# EAGLE schematic PhotonOnAStick (EAGLE 7.3.0)
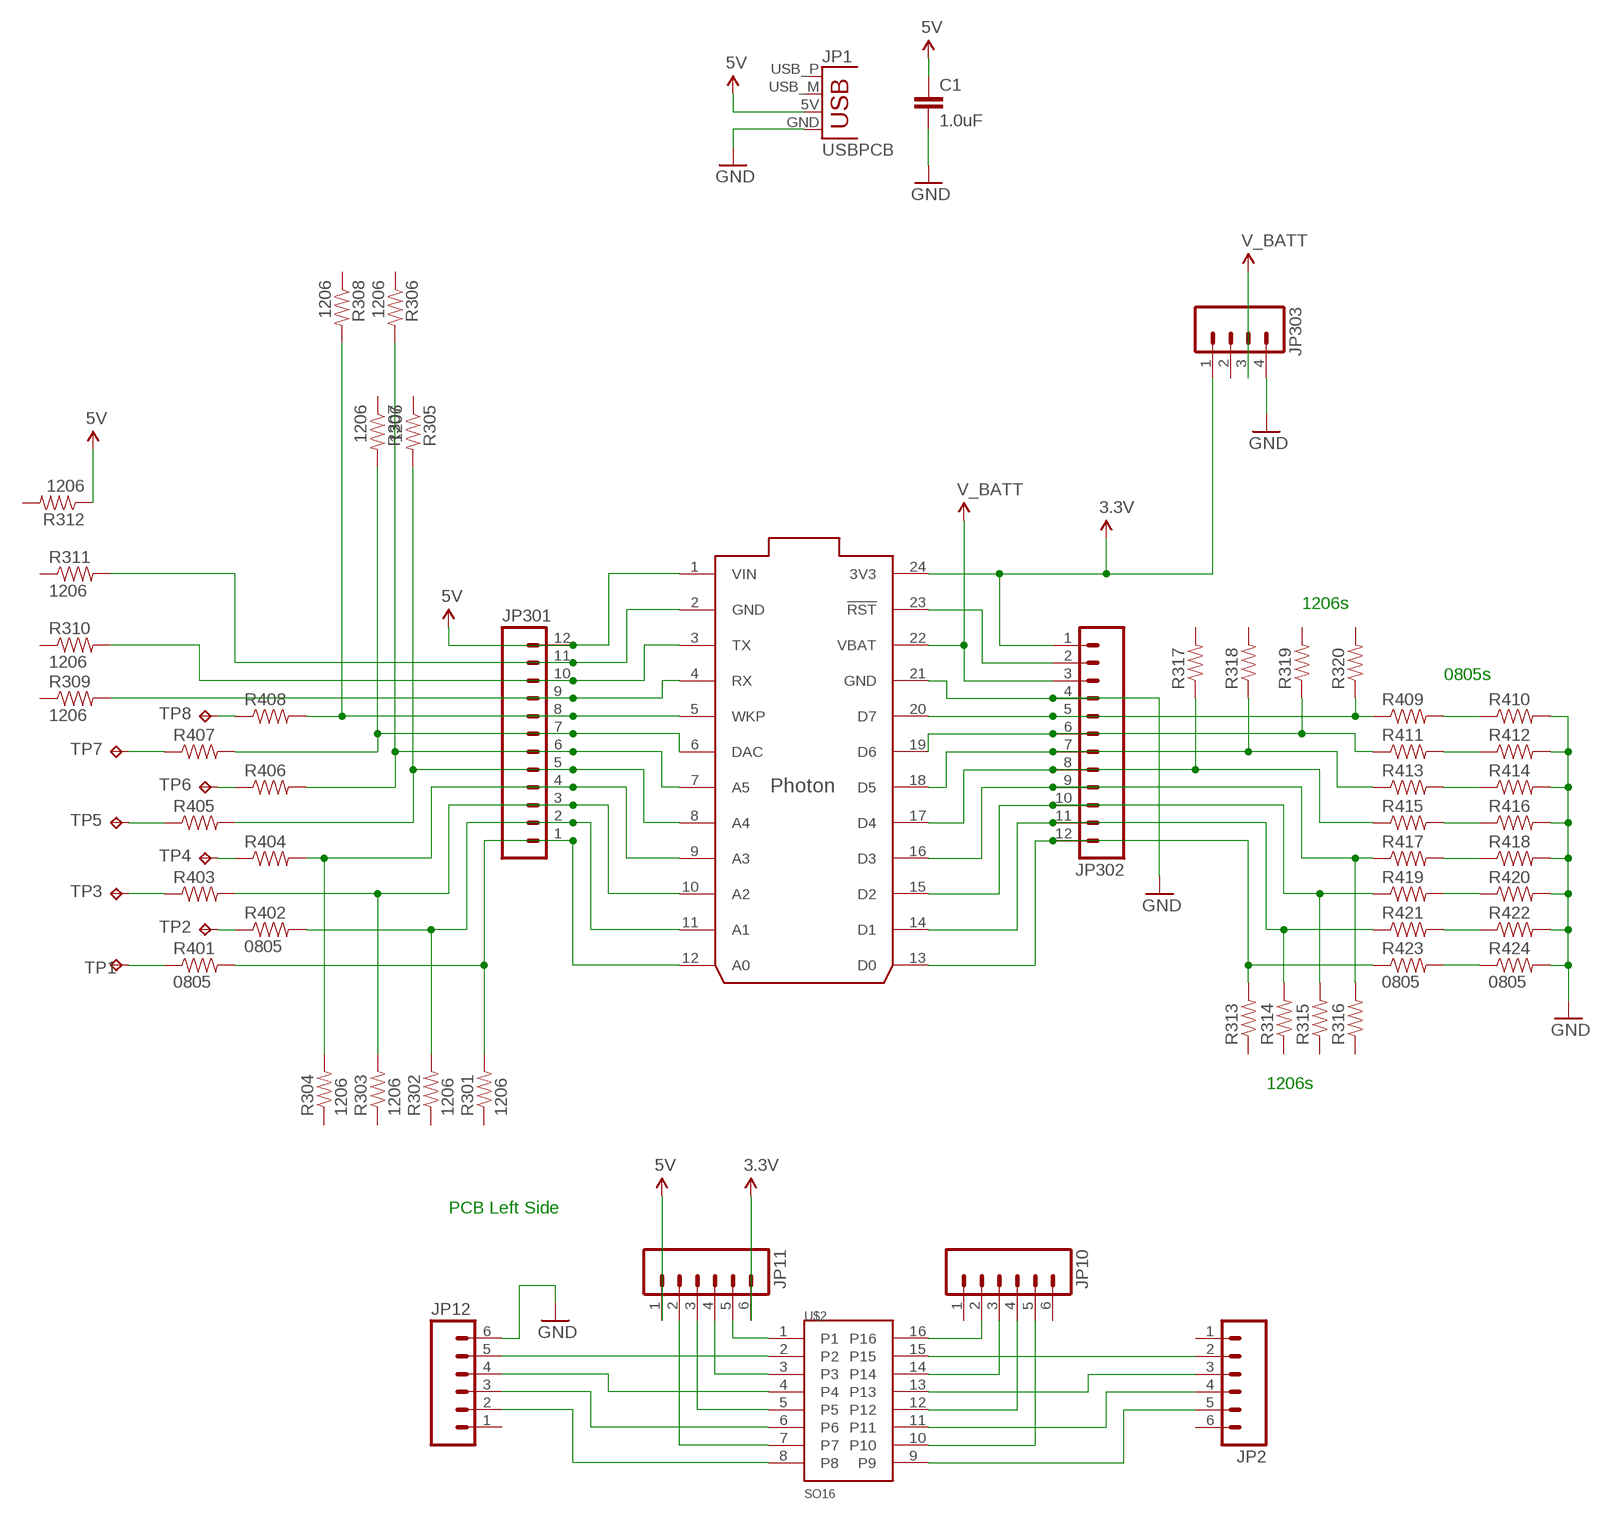
[diagram p0: schematic, sheet 1, part 1 of 2]
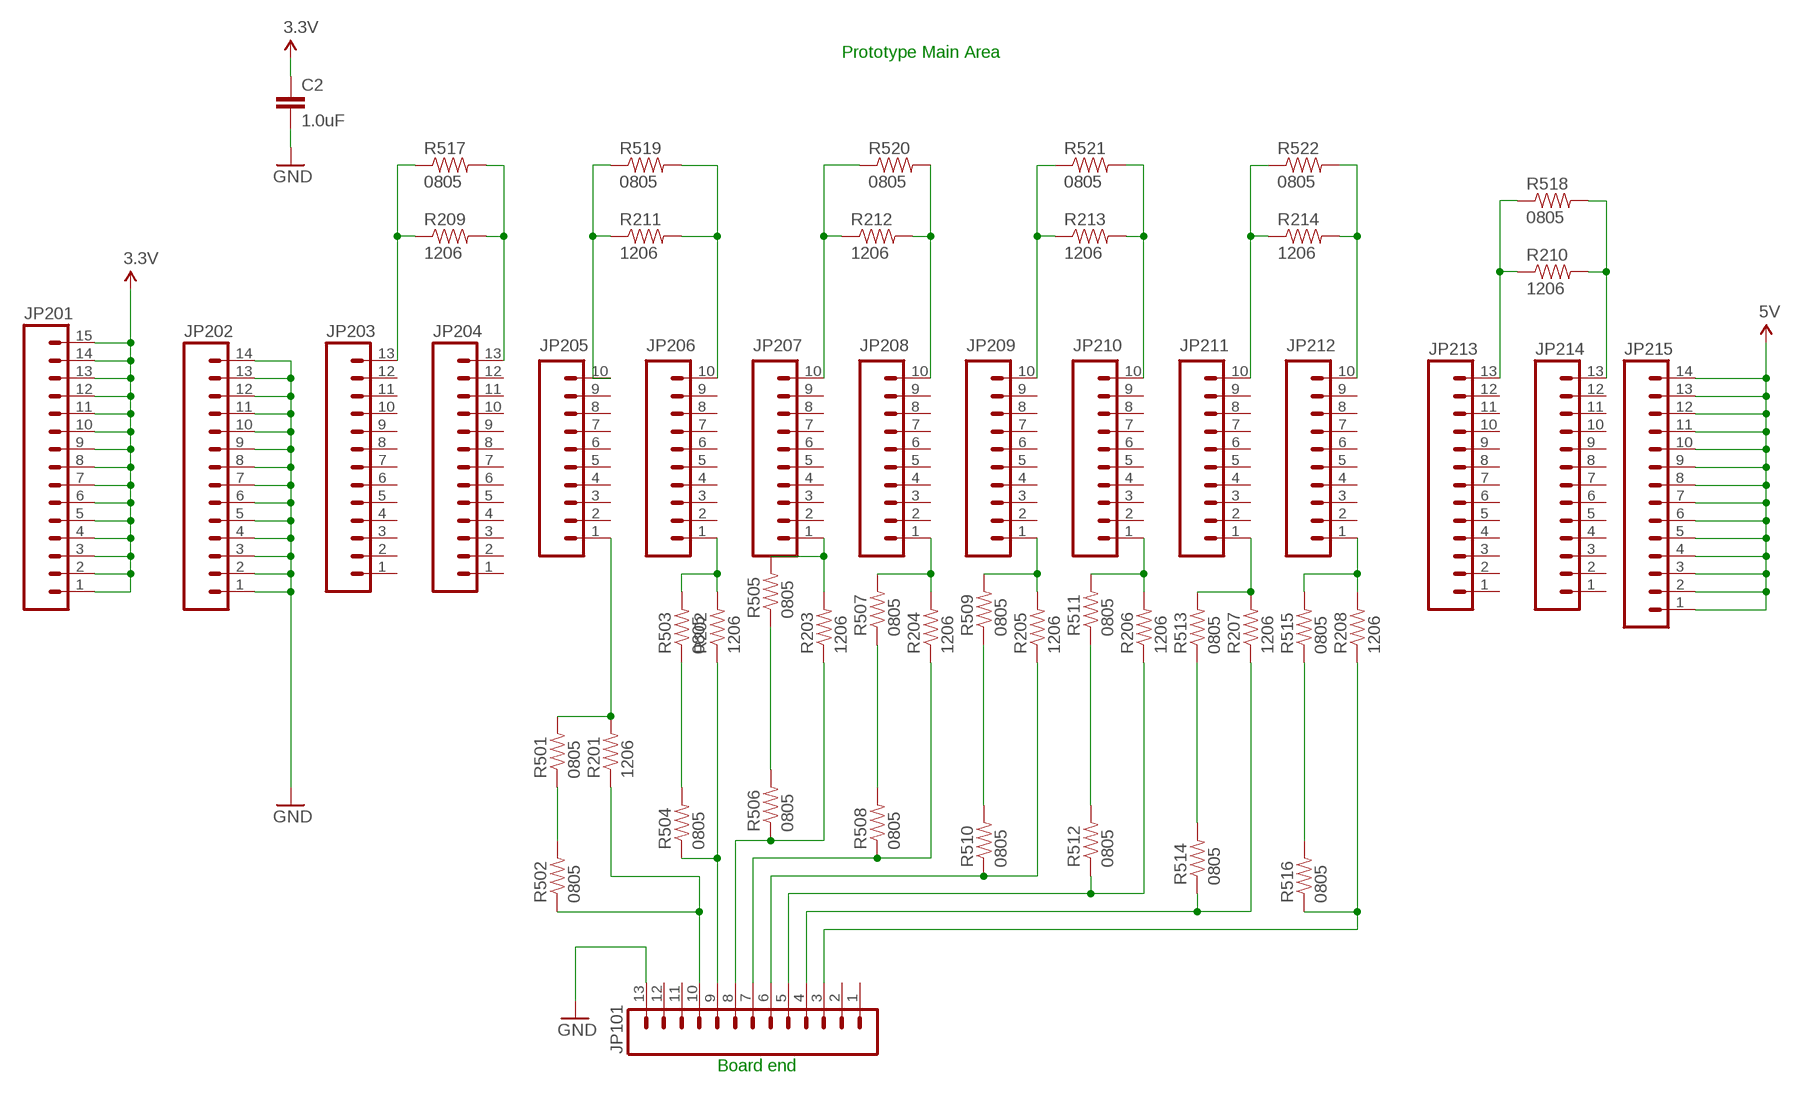
[diagram p1: schematic, sheet 1, part 2 of 2]

## Parts
C1  1.0uF  1.0UF-25V-+80/-20(0805)"  [0805-CAP]
C2  1.0uF  1.0UF-25V-+80/-20(0805)"  [0805-CAP]
JP1  USBPCB  [USB-A-PCB]
JP2  M06SILK_FEMALE_PTH  [1X06]
JP10  M06SILK_FEMALE_PTH  [1X06]
JP11  M06SILK_FEMALE_PTH  [1X06]
JP12  M06SILK_FEMALE_PTH  [1X06]
JP101  M13  [1X13]
JP201  M15  [1X15]
JP202  M14  [1X14]
JP203  M13  [1X13]
JP204  M13  [1X13]
JP205  M10SILK_FEMALE_PTH  [1X10]
JP206  M10SILK_FEMALE_PTH  [1X10]
JP207  M10SILK_FEMALE_PTH  [1X10]
JP208  M10SILK_FEMALE_PTH  [1X10]
JP209  M10SILK_FEMALE_PTH  [1X10]
JP210  M10SILK_FEMALE_PTH  [1X10]
JP211  M10SILK_FEMALE_PTH  [1X10]
JP212  M10SILK_FEMALE_PTH  [1X10]
JP213  M13  [1X13]
JP214  M13  [1X13]
JP215  M14  [1X14]
JP301  M12PTH  [1X12]
JP302  M12PTH  [1X12]
JP303  M04PTH  [1X04]
R201  1206  RESISTOR1206  [1206]
R202  1206  RESISTOR1206  [1206]
R203  1206  RESISTOR1206  [1206]
R204  1206  RESISTOR1206  [1206]
R205  1206  RESISTOR1206  [1206]
R206  1206  RESISTOR1206  [1206]
R207  1206  RESISTOR1206  [1206]
R208  1206  RESISTOR1206  [1206]
R209  1206  RESISTOR1206  [1206]
R210  1206  RESISTOR1206  [1206]
R211  1206  RESISTOR1206  [1206]
R212  1206  RESISTOR1206  [1206]
R213  1206  RESISTOR1206  [1206]
R214  1206  RESISTOR1206  [1206]
R301  1206  RESISTOR1206  [1206]
R302  1206  RESISTOR1206  [1206]
R303  1206  RESISTOR1206  [1206]
R304  1206  RESISTOR1206  [1206]
R305  1206  RESISTOR1206  [1206]
R306  1206  RESISTOR1206  [1206]
R307  1206  RESISTOR1206  [1206]
R308  1206  RESISTOR1206  [1206]
R309  1206  RESISTOR1206  [1206]
R310  1206  RESISTOR1206  [1206]
R311  1206  RESISTOR1206  [1206]
R312  1206  RESISTOR1206  [1206]
R313  1206  RESISTOR1206  [1206]
R314  1206  RESISTOR1206  [1206]
R315  1206  RESISTOR1206  [1206]
R316  1206  RESISTOR1206  [1206]
R317  1206  RESISTOR1206  [1206]
R318  1206  RESISTOR1206  [1206]
R319  1206  RESISTOR1206  [1206]
R320  1206  RESISTOR1206  [1206]
R401  0805  RESISTOR0805-RES  [0805]
R402  0805  RESISTOR0805-RES  [0805]
R403  0805  RESISTOR0805-RES  [0805]
R404  0805  RESISTOR0805-RES  [0805]
R405  0805  RESISTOR0805-RES  [0805]
R406  0805  RESISTOR0805-RES  [0805]
R407  0805  RESISTOR0805-RES  [0805]
R408  0805  RESISTOR0805-RES  [0805]
R409  0805  RESISTOR0805-RES  [0805]
R410  0805  RESISTOR0805-RES  [0805]
R411  0805  RESISTOR0805-RES  [0805]
R412  0805  RESISTOR0805-RES  [0805]
R413  0805  RESISTOR0805-RES  [0805]
R414  0805  RESISTOR0805-RES  [0805]
R415  0805  RESISTOR0805-RES  [0805]
R416  0805  RESISTOR0805-RES  [0805]
R417  0805  RESISTOR0805-RES  [0805]
R418  0805  RESISTOR0805-RES  [0805]
R419  0805  RESISTOR0805-RES  [0805]
R420  0805  RESISTOR0805-RES  [0805]
R421  0805  RESISTOR0805-RES  [0805]
R422  0805  RESISTOR0805-RES  [0805]
R423  0805  RESISTOR0805-RES  [0805]
R424  0805  RESISTOR0805-RES  [0805]
R501  0805  RESISTOR0805-RES  [0805]
R502  0805  RESISTOR0805-RES  [0805]
R503  0805  RESISTOR0805-RES  [0805]
R504  0805  RESISTOR0805-RES  [0805]
R505  0805  RESISTOR0805-RES  [0805]
R506  0805  RESISTOR0805-RES  [0805]
R507  0805  RESISTOR0805-RES  [0805]
R508  0805  RESISTOR0805-RES  [0805]
R509  0805  RESISTOR0805-RES  [0805]
R510  0805  RESISTOR0805-RES  [0805]
R511  0805  RESISTOR0805-RES  [0805]
R512  0805  RESISTOR0805-RES  [0805]
R513  0805  RESISTOR0805-RES  [0805]
R514  0805  RESISTOR0805-RES  [0805]
R515  0805  RESISTOR0805-RES  [0805]
R516  0805  RESISTOR0805-RES  [0805]
R517  0805  RESISTOR0805-RES  [0805]
R518  0805  RESISTOR0805-RES  [0805]
R519  0805  RESISTOR0805-RES  [0805]
R520  0805  RESISTOR0805-RES  [0805]
R521  0805  RESISTOR0805-RES  [0805]
R522  0805  RESISTOR0805-RES  [0805]
TP1  TPB1,27  [B1,27]
TP2  TPB1,27  [B1,27]
TP3  TPB1,27  [B1,27]
TP4  TPB1,27  [B1,27]
TP5  TPB1,27  [B1,27]
TP6  TPB1,27  [B1,27]
TP7  TPB1,27  [B1,27]
TP8  TPB1,27  [B1,27]
U$1  PHOTON_WITH_HEADERS  [PHOTON]
U$2  SO16  [SO16]

## Nets
3.3V: C2.1 JP11.6 JP201.1 JP201.2 JP201.3 JP201.4 JP201.5 JP201.6 JP201.7 JP201.8 JP201.9 JP201.10 JP201.11 JP201.12 JP201.13 JP201.14 JP201.15 JP302.1 JP303.1 U$1.24(3V3)
5V: C1.1 JP1.5V(VBUS) JP11.1 JP215.1 JP215.2 JP215.3 JP215.4 JP215.5 JP215.6 JP215.7 JP215.8 JP215.9 JP215.10 JP215.11 JP215.12 JP215.13 JP215.14 JP301.12 R312.1 U$1.1(VIN)
GND: C1.2 C2.2 JP1.GND JP12.6 JP101.13 JP202.1 JP202.2 JP202.3 JP202.4 JP202.5 JP202.6 JP202.7 JP202.8 JP202.9 JP202.10 JP202.11 JP202.12 JP202.13 JP202.14 JP302.4 JP303.4 R410.2 R412.2 R414.2 R416.2 R418.2 R420.2 R422.2 R424.2 U$1.21(GND)
N$1: JP214.13 R210.2 R518.2
N$2: JP206.1 R202.2 R503.2
N$3: JP301.11 R311.2 U$1.2(GND)
N$4: JP301.10 R310.2 U$1.3(TX)
N$5: JP301.9 R309.2 U$1.4(RX)
N$6: JP301.8 R308.2 R408.2 U$1.5(WKP)
N$7: JP301.7 R307.2 R407.2 U$1.6(DAC)
N$8: JP301.6 R306.2 R406.2 U$1.7(A5)
N$9: JP301.5 R305.2 R405.2 U$1.8(A4)
N$10: JP301.4 R304.2 R404.2 U$1.9(A3)
N$11: JP301.3 R303.2 R403.2 U$1.10(A2)
N$12: JP301.2 R302.2 R402.2 U$1.11(A1)
N$13: JP301.1 R301.2 R401.2 U$1.12(A0)
N$14: JP204.13 R209.2 R517.2
N$15: JP213.13 R210.1 R518.1
N$16: JP302.7 R318.1 R413.1 U$1.18(D5)
N$17: JP302.8 R317.1 R415.1 U$1.17(D4)
N$18: JP302.9 R316.2 R417.1 U$1.16(D3)
N$19: JP302.10 R315.2 R419.1 U$1.15(D2)
N$20: JP302.11 R314.2 R421.1 U$1.14(D1)
N$21: JP302.12 R313.2 R423.1 U$1.13(D0)
N$22: JP209.1 R205.2 R509.2
N$23: R513.1 R514.2
N$24: JP302.2 U$1.23(!RST)
N$25: R409.2 R410.1
N$26: JP207.1 R203.2 R505.2
N$27: JP208.1 R204.2 R507.2
N$28: JP101.9 R202.1 R504.1
N$29: JP101.8 R203.1 R506.1
N$30: JP101.7 R204.1 R508.1
N$31: JP101.6 R205.1 R510.1
N$32: JP205.1 R201.2 R501.2
N$33: JP101.10 R201.1 R502.1
N$34: JP210.1 R206.2 R511.2
N$35: JP211.1 R207.2 R513.2
N$36: JP101.5 R206.1 R512.1
N$37: JP101.4 R207.1 R514.1
N$38: JP302.5 R320.1 R409.1 U$1.20(D7)
N$39: JP302.6 R319.1 R411.1 U$1.19(D6)
N$40: R515.1 R516.2
N$43: R511.1 R512.2
N$44: R423.2 R424.1
N$45: R421.2 R422.1
N$46: R419.2 R420.1
N$47: R417.2 R418.1
N$48: R415.2 R416.1
N$49: R413.2 R414.1
N$50: R411.2 R412.1
N$51: R509.1 R510.2
N$52: R503.1 R504.2
N$53: R501.1 R502.2
N$54: R505.1 R506.2
N$55: JP203.13 R209.1 R517.1
N$56: JP212.1 R208.2 R515.2
N$57: JP101.3 R208.1 R516.1
N$58: R408.1 TP8.TP
N$59: R407.1 TP7.TP
N$60: R405.1 TP5.TP
N$61: R404.1 TP4.TP
N$62: R403.1 TP3.TP
N$63: R401.1 TP1.TP
N$64: R402.1 TP2.TP
N$65: R406.1 TP6.TP
N$66: JP205.10 R211.1 R519.1
N$67: JP206.10 R211.2 R519.2
N$68: JP208.10 R212.2 R520.2
N$69: JP210.10 R213.2 R521.2
N$70: JP212.10 R214.2 R522.2
N$71: JP207.10 R212.1 R520.1
N$72: JP209.10 R213.1 R521.1
N$73: JP211.10 R214.1 R522.1
N$74: JP11.5 U$2.1
N$75: JP11.4 U$2.3
N$76: JP11.3 U$2.5
N$77: JP11.2 U$2.7
N$78: JP12.5 U$2.2
N$79: JP12.4 U$2.4
N$80: JP12.3 U$2.6
N$81: JP12.2 U$2.8
N$82: JP10.2 U$2.16
N$83: JP2.2 U$2.15
N$84: JP10.3 U$2.14
N$85: JP10.4 U$2.12
N$86: JP10.5 U$2.10
N$87: JP2.3 U$2.13
N$88: JP2.4 U$2.11
N$89: JP2.5 U$2.9
N$90: R507.1 R508.2
V_BATT: JP302.3 JP303.3 U$1.22(VBAT)
Unconnected: JP1.USB_M(D-) JP1.USB_P(D+) JP2.1 JP2.6 JP10.1 JP10.6 JP12.1 JP101.1 JP101.2 JP101.11 JP101.12 JP203.1 JP203.2 JP203.3 JP203.4 JP203.5 JP203.6 JP203.7 JP203.8 JP203.9 JP203.10 JP203.11 JP203.12 JP204.1 JP204.2 JP204.3 JP204.4 JP204.5 JP204.6 JP204.7 JP204.8 JP204.9 JP204.10 JP204.11 JP204.12 JP205.2 JP205.3 JP205.4 JP205.5 JP205.6 JP205.7 JP205.8 JP205.9 JP206.2 JP206.3 JP206.4 JP206.5 JP206.6 JP206.7 JP206.8 JP206.9 JP207.2 JP207.3 JP207.4 JP207.5 JP207.6 JP207.7 JP207.8 JP207.9 JP208.2 JP208.3 JP208.4 JP208.5 JP208.6 JP208.7 JP208.8 JP208.9 JP209.2 JP209.3 JP209.4 JP209.5 JP209.6 JP209.7 JP209.8 JP209.9 JP210.2 JP210.3 JP210.4 JP210.5 JP210.6 JP210.7 JP210.8 JP210.9 JP211.2 JP211.3 JP211.4 JP211.5 JP211.6 JP211.7 JP211.8 JP211.9 JP212.2 JP212.3 JP212.4 JP212.5 JP212.6 JP212.7 JP212.8 JP212.9 JP213.1 JP213.2 JP213.3 JP213.4 JP213.5 JP213.6 JP213.7 JP213.8 JP213.9 JP213.10 JP213.11 JP213.12 JP214.1 JP214.2 JP214.3 JP214.4 JP214.5 JP214.6 JP214.7 JP214.8 JP214.9 JP214.10 JP214.11 JP214.12 JP303.2 R301.1 R302.1 R303.1 R304.1 R305.1 R306.1 R307.1 R308.1 R309.1 R310.1 R311.1 R312.2 R313.1 R314.1 R315.1 R316.1 R317.2 R318.2 R319.2 R320.2

## Notes on the sheet
- Prototype Main Area
- 1206s
- 0805s
- 1206s
- Board end
- PCB Left Side

## Library data of the parts
C1 C2 = SparkFun-Capacitors:1.0UF-25V-+80/-20(0805): CAP-11625; PROD_ID: CAP-11625
JP1 = SparkFun-Connectors:USB: USB Connectors USB-B-PTH is fully proven SKU : PRT-00139/CONN-08278 USB-miniB is fully proven SKU : PRT-00587 USB-A-PCB is untested. USB-A-H is throughly reviewed, but untested. Spark Fun Electronics SKU : PRT-00437 USB-B-SMT is throughly reviewed, but untested. Needs silkscreen touching up. USB-A-S has not been used/tested USB-MB-H has not been used/tested USB-MICROB has been used. CONN-09505
JP2 JP10-JP12 = SparkFun-Connectors:M06: Header 6 Standard 6-pin 0.1" header. Use with straight break away headers (SKU : PRT-00116), right angle break away headers (PRT-00553), swiss pins (PRT-00743), machine pins (PRT-00117), and female headers (PRT-00115). Molex polarized connector foot print use with SKU : PRT-08094 with associated crimp pins and housings. NOTES ON THE VARIANTS LOCK and LOCK_LONGPADS... This footprint was designed to help hold the alignment of a through-hole component (i.e. 6-pin header) while soldering it into place. You may notice that each hole has been shifted either up or down by 0.005 of an inch from it's more standard position (which is a perfectly straight line). This slight alteration caused the pins (the squares in the middle) to touch the edges of the holes. Because they are alternating, it causes a "brace" to hold the component in place. 0.005 has proven to be the perfect amount of "off-center" position when using our standard breakaway headers. Although looks a little odd when you look at the bare footprint, once you have a header in there, the alteration is very hard to notice. Also,if you push a header all the way into place, it is covered up entirely on the bottom side. This idea of altering the position of holes to aid alignment will be further integrated into the Sparkfun Library for other footprints. It can help hold any component with 3 or more connection pins.; PROD_ID: CONN-08437
JP101 JP203 JP204 JP213 JP214 = SparkFun-Connectors:M13: 13-pin single row .1" header
JP201 = SparkFun-Connectors:M15: Header 15 Standard 15-pin 0.1" header. Use with straight break away headers (SKU : PRT-00116), right angle break away headers (PRT-00553), swiss pins (PRT-00743), machine pins (PRT-00117), and female headers (PRT-00115).
JP202 JP215 = SparkFun-Connectors:M14: Header 14 Standard 14-pin 0.1" header. Use with straight break away headers (SKU : PRT-00116), right angle break away headers (PRT-00553), swiss pins (PRT-00743), machine pins (PRT-00117), and female headers (PRT-00115).
JP205-JP212 = SparkFun-Connectors:M10: Header 10 Standard 10-pin 0.1" header. Use with straight break away headers (SKU : PRT-00116), right angle break away headers (PRT-00553), swiss pins (PRT-00743), machine pins (PRT-00117), and female headers (PRT-00115).; PROD_ID: CONN-11563
JP301 JP302 = SparkFun-Connectors:M12: Header 12 Standard 12-pin 0.1" header. Use with straight break away headers (SKU : PRT-00116), right angle break away headers (PRT-00553), swiss pins (PRT-00743), machine pins (PRT-00117), and female headers (PRT-00115).
JP303 = SparkFun-Connectors:M04: Header 4 Standard 4-pin 0.1" header. Use with straight break away headers (SKU : PRT-00116), right angle break away headers (PRT-00553), swiss pins (PRT-00743), machine pins (PRT-00117), and female headers (PRT-00115). Molex polarized connector foot print use with SKU : PRT-08231 with associated crimp pins and housings. 1MM SMD Version SKU: PRT-10208
R201-R214 R301-R320 R401-R424 R501-R522 = SparkFun-Resistors:RESISTOR: Resistor Basic schematic elements and footprints for 0603, 1206, and PTH resistors.
TP1-TP8 = testpad:TP: Test pad
U$1 = Spark:PHOTON
U$2 = Tinamous:SO16